# EAGLE design elysium_v0_7 (EAGLE 6.5.0)
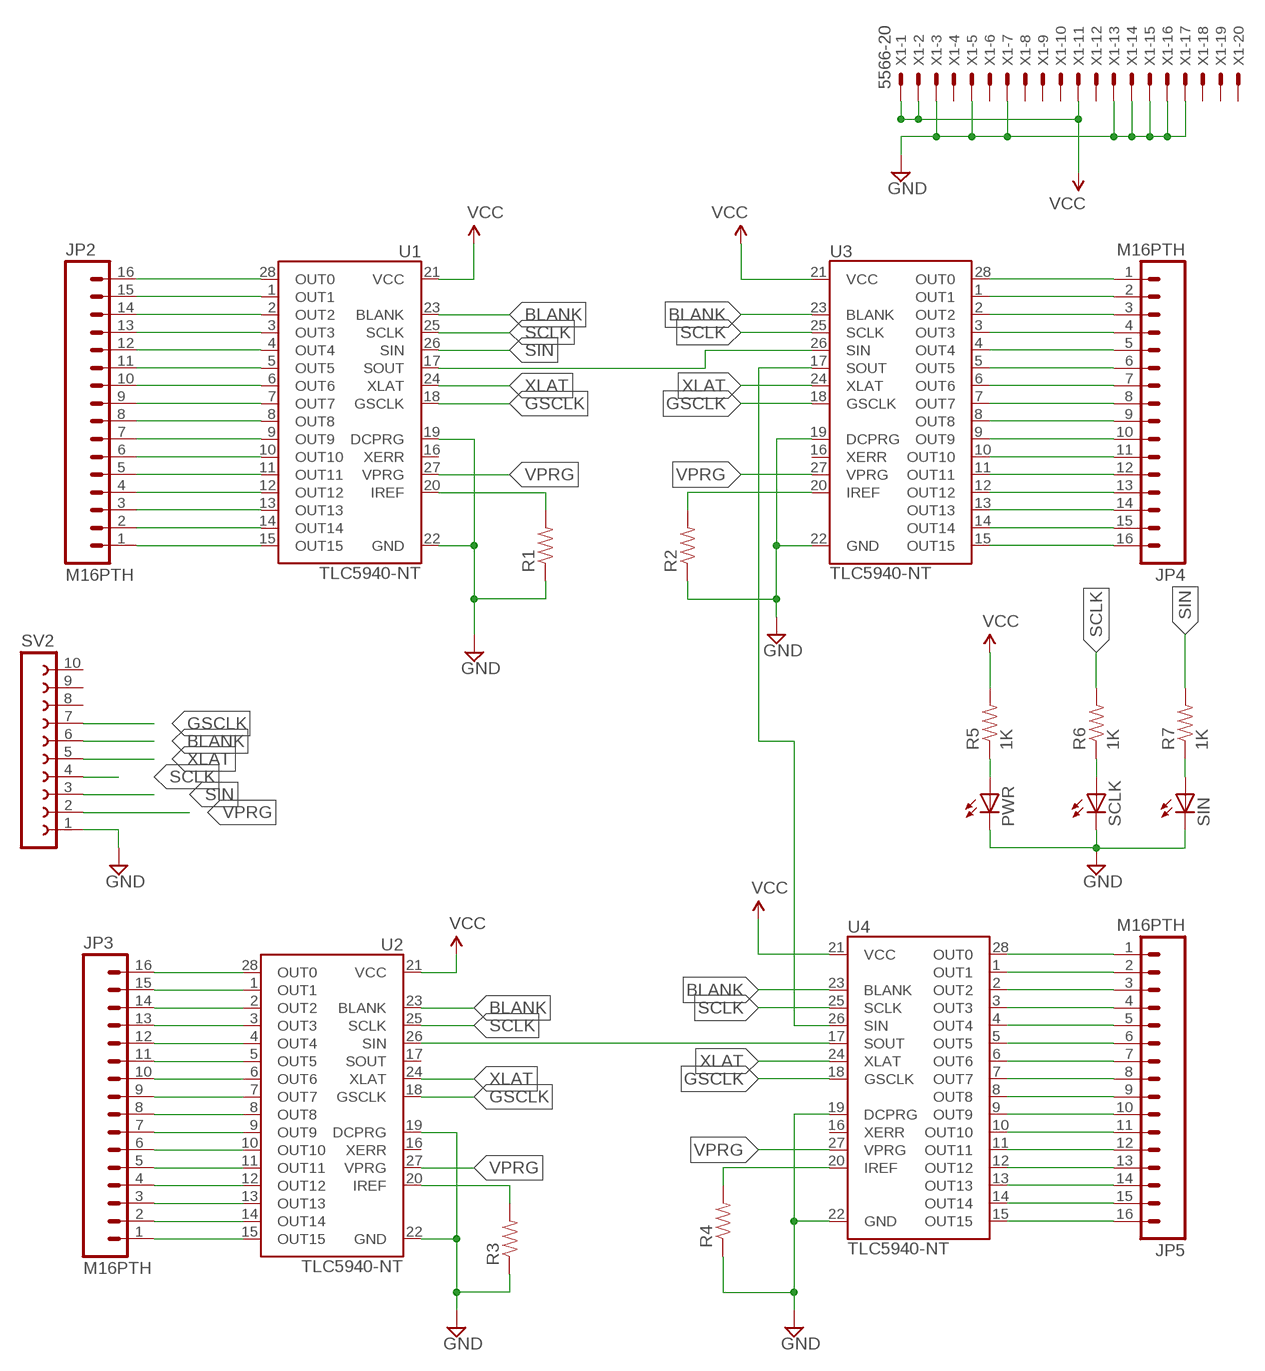
[diagram p0: schematic, sheet 1]

## Parts
JP2  M16PTH  [1X16]
JP3  M16PTH  [1X16]
JP4  M16PTH  [1X16]
JP5  M16PTH  [1X16]
PWR  LED5MM  [LED5MM]
R1  RESISTOREZ  [AXIAL-0.3EZ]
R2  RESISTOREZ  [AXIAL-0.3EZ]
R3  RESISTOREZ  [AXIAL-0.3EZ]
R4  RESISTOREZ  [AXIAL-0.3EZ]
R5  1K  RESISTOREZ  [AXIAL-0.3EZ]
R6  1K  RESISTOREZ  [AXIAL-0.3EZ]
R7  1K  RESISTOREZ  [AXIAL-0.3EZ]
SCLK  LED5MM  [LED5MM]
SIN  LED5MM  [LED5MM]
SV2  FE10-1  [FE10]
U1  TLC5940-NT  [DIL28-3]
U2  TLC5940-NT  [DIL28-3]
U3  TLC5940-NT  [DIL28-3]
U4  TLC5940-NT  [DIL28-3]
X1  5566-20  [5566-20]

## Nets
BLANK: SV2.6 U1.23(BLANK) U2.23(BLANK) U3.23(BLANK) U4.23(BLANK)
GND: PWR.K(C) R1.P$1 R2.P$1 R3.P$1 R4.P$1 SCLK.K(C) SIN.K(C) SV2.1 U1.19(DCPRG) U1.22(GND) U2.19(DCPRG) U2.22(GND) U3.19(DCPRG) U3.22(GND) U4.19(DCPRG) U4.22(GND) X1.3 X1.5 X1.7 X1.13 X1.14 X1.15 X1.16 X1.17
GSCLK: SV2.7 U1.18(GSCLK) U2.18(GSCLK) U3.18(GSCLK) U4.18(GSCLK)
N$1: JP2.16 U1.28(OUT0)
N$2: JP2.15 U1.1(OUT1)
N$3: JP2.14 U1.2(OUT2)
N$4: JP2.13 U1.3(OUT3)
N$5: JP2.12 U1.4(OUT4)
N$6: JP2.11 U1.5(OUT5)
N$7: JP2.10 U1.6(OUT6)
N$8: JP2.9 U1.7(OUT7)
N$9: JP2.8 U1.8(OUT8)
N$10: JP2.7 U1.9(OUT9)
N$11: JP2.6 U1.10(OUT10)
N$12: JP2.5 U1.11(OUT11)
N$13: JP2.4 U1.12(OUT12)
N$14: JP2.3 U1.13(OUT13)
N$15: JP2.2 U1.14(OUT14)
N$16: JP2.1 U1.15(OUT15)
N$17: JP4.1 U3.28(OUT0)
N$18: JP4.2 U3.1(OUT1)
N$19: JP4.3 U3.2(OUT2)
N$20: JP4.4 U3.3(OUT3)
N$21: JP4.5 U3.4(OUT4)
N$22: JP4.6 U3.5(OUT5)
N$23: JP4.7 U3.6(OUT6)
N$24: JP4.8 U3.7(OUT7)
N$25: JP4.9 U3.8(OUT8)
N$26: JP4.10 U3.9(OUT9)
N$27: JP4.11 U3.10(OUT10)
N$28: JP4.12 U3.11(OUT11)
N$29: JP4.13 U3.12(OUT12)
N$30: JP4.14 U3.13(OUT13)
N$31: JP4.15 U3.14(OUT14)
N$32: JP4.16 U3.15(OUT15)
N$33: JP3.16 U2.28(OUT0)
N$34: JP3.15 U2.1(OUT1)
N$35: JP3.14 U2.2(OUT2)
N$36: JP3.13 U2.3(OUT3)
N$37: JP3.12 U2.4(OUT4)
N$38: JP3.11 U2.5(OUT5)
N$39: JP3.10 U2.6(OUT6)
N$40: JP3.9 U2.7(OUT7)
N$41: JP3.8 U2.8(OUT8)
N$42: JP3.7 U2.9(OUT9)
N$43: JP3.6 U2.10(OUT10)
N$44: JP3.5 U2.11(OUT11)
N$45: JP3.4 U2.12(OUT12)
N$46: JP3.3 U2.13(OUT13)
N$47: JP3.2 U2.14(OUT14)
N$48: JP3.1 U2.15(OUT15)
N$49: JP5.1 U4.28(OUT0)
N$50: JP5.2 U4.1(OUT1)
N$51: JP5.3 U4.2(OUT2)
N$52: JP5.4 U4.3(OUT3)
N$53: JP5.5 U4.4(OUT4)
N$54: JP5.6 U4.5(OUT5)
N$55: JP5.7 U4.6(OUT6)
N$56: JP5.8 U4.7(OUT7)
N$57: JP5.9 U4.8(OUT8)
N$58: JP5.10 U4.9(OUT9)
N$59: JP5.11 U4.10(OUT10)
N$60: JP5.12 U4.11(OUT11)
N$61: JP5.13 U4.12(OUT12)
N$62: JP5.14 U4.13(OUT13)
N$63: JP5.15 U4.14(OUT14)
N$64: JP5.16 U4.15(OUT15)
N$65: U1.17(SOUT) U3.26(SIN)
N$66: U3.17(SOUT) U4.26(SIN)
N$67: U2.26(SIN) U4.17(SOUT)
N$68: R1.P$2 U1.20(IREF)
N$69: PWR.A R5.P$1
N$70: R2.P$2 U3.20(IREF)
N$74: R6.P$1 SCLK.A
N$75: R3.P$2 U2.20(IREF)
N$76: R7.P$1 SIN.A
N$77: R4.P$2 U4.20(IREF)
SCLK: R6.P$2 SV2.4 U1.25(SCLK) U2.25(SCLK) U3.25(SCLK) U4.25(SCLK)
SIN: R7.P$2 SV2.3 U1.26(SIN)
VCC: R5.P$2 U1.21(VCC) U2.21(VCC) U3.21(VCC) U4.21(VCC) X1.1 X1.2 X1.11
VPRG: SV2.2 U1.27(VPRG) U2.27(VPRG) U3.27(VPRG) U4.27(VPRG)
XLAT: SV2.5 U1.24(XLAT) U2.24(XLAT) U3.24(XLAT) U4.24(XLAT)
Unconnected: SV2.8 SV2.9 SV2.10 U1.16(XERR) U2.16(XERR) U2.17(SOUT) U3.16(XERR) U4.16(XERR) X1.4 X1.6 X1.8 X1.9 X1.10 X1.12 X1.18 X1.19 X1.20

## Library data of the parts
JP2-JP5 = SparkFun-Connectors:M16: 1x16 .1" header
PWR SCLK SIN = adafruit:LED: LED OSRAM: - CHIPLED LG R971, LG N971, LY N971, LG Q971, LY Q971, LO R971, LY R971 LH N974, LH R974 LS Q976, LO Q976, LY Q976 LO Q996 - Hyper CHIPLED LW Q18S LB Q993, LB Q99A, LB R99A - SideLED LS A670, LO A670, LY A670, LG A670, LP A670 LB A673, LV A673, LT A673, LW A673 LH A674 LY A675 LS A676, LA A676, LO A676, LY A676, LW A676 LS A679, LY A679, LG A679 - Hyper Micro SIDELED® LS Y876, LA Y876, LO Y876, LY Y876 LT Y87S - SmartLED LW L88C, LW L88S LB L89C, LB L89S, LG L890 LS L89K, LO L89K, LY L89K LS L896, LA L896, LO L896, LY L896 - TOPLED LS T670, LO T670, LY T670, LG T670, LP T670 LSG T670, LSP T670, LSY T670, LOP T670, LYG T670 LG T671, LOG T671, LSG T671 LB T673, LV T673, LT T673, LW T673 LH T674 LS T676, LA T676, LO T676, LY T676, LB T676, LH T676, LSB T676, LW T676 LB T67C, LV T67C, LT T67C, LS T67K, LO T67K, LY T67K, LW E67C LS E67B, LA E67B, LO E67B, LY E67B, LB E67C, LV E67C, LT E67C LW T67C LS T679, LY T679, LG T679 LS T770, LO T770, LY T770, LG T770, LP T770 LB T773, LV T773, LT T773, LW T773 LH T774 LS E675, LA E675, LY E675, LS T675 LS T776, LA T776, LO T776, LY T776, LB T776 LHGB T686 LT T68C, LB T68C - Hyper Mini TOPLED® LB M676 - Mini TOPLED Santana® LG M470 LS M47K, LO M47K, LY M47K Source: http://www.osram.convergy.de/
R1-R7 = SparkFun-Resistors:RESISTOR: Resistor Basic schematic elements and footprints for 0603, 1206, and PTH resistors.
SV2 = con-lsta:FE10-1: FEMALE HEADER; OC_FARNELL: unknown; OC_NEWARK: unknown
U1-U4 = SparkFun-DigitalIC:TLC5940: 16-channel LED Driver with Dot Correction and Grayscale PWM Control The TLC5940 is a 16-channel, constant-current sink LED driver. Each channel has an individually adjustable 4096-step grayscale PWM brightness control and a 64-step, constant-current sink (dot correction). The dot correction adjusts the brightness variations between LED channels and other LED drivers. The dot correction data is stored in an integrated EEPROM. Both grayscale control and dot correction are accessible via a serial interface. A single external resistor sets the maximum current value of all 16 channels. Packages: 28-pin HTSSOP 32-pin 5x5mm QFN 28-pin DIP
X1 = con-molex:5566-20: Mini FIT connector 20 pol ATX PC-Motherboard Power connector Source: http://www.molex.com; OC_FARNELL: unknown; OC_NEWARK: unknown

## Board
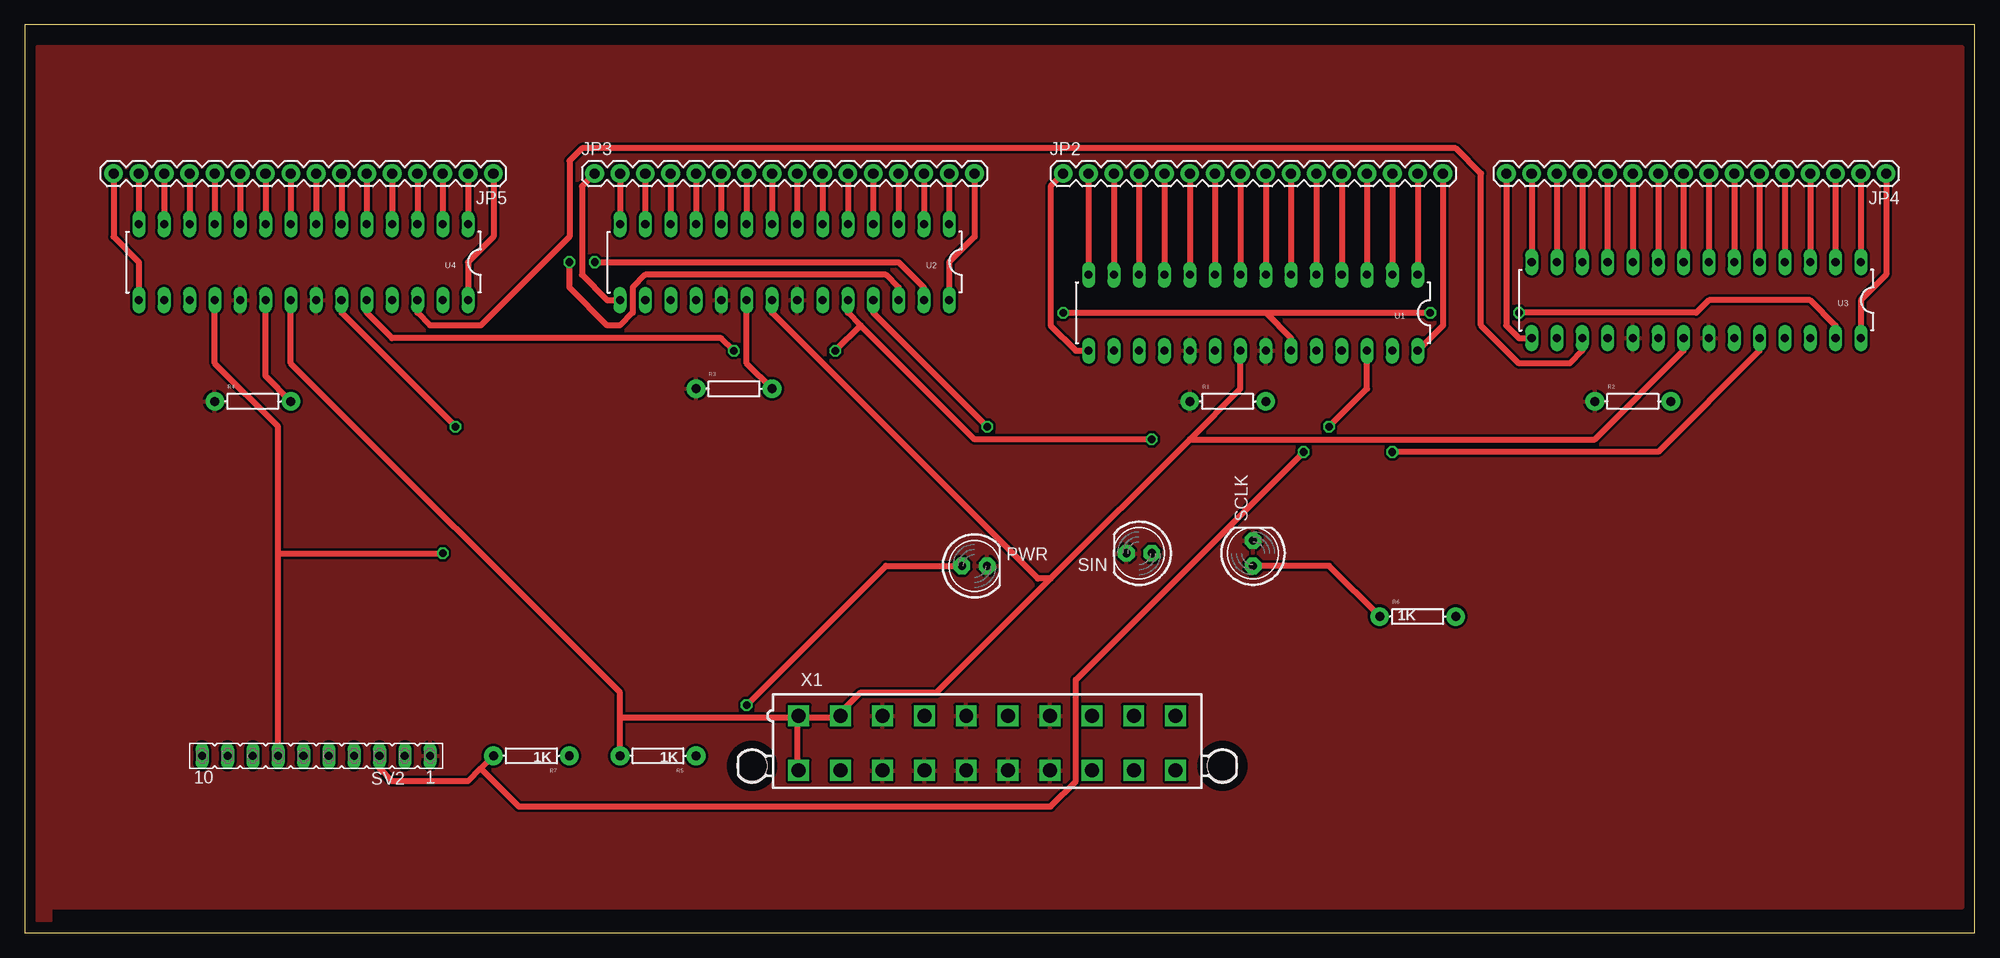
[diagram p1: board, top side]
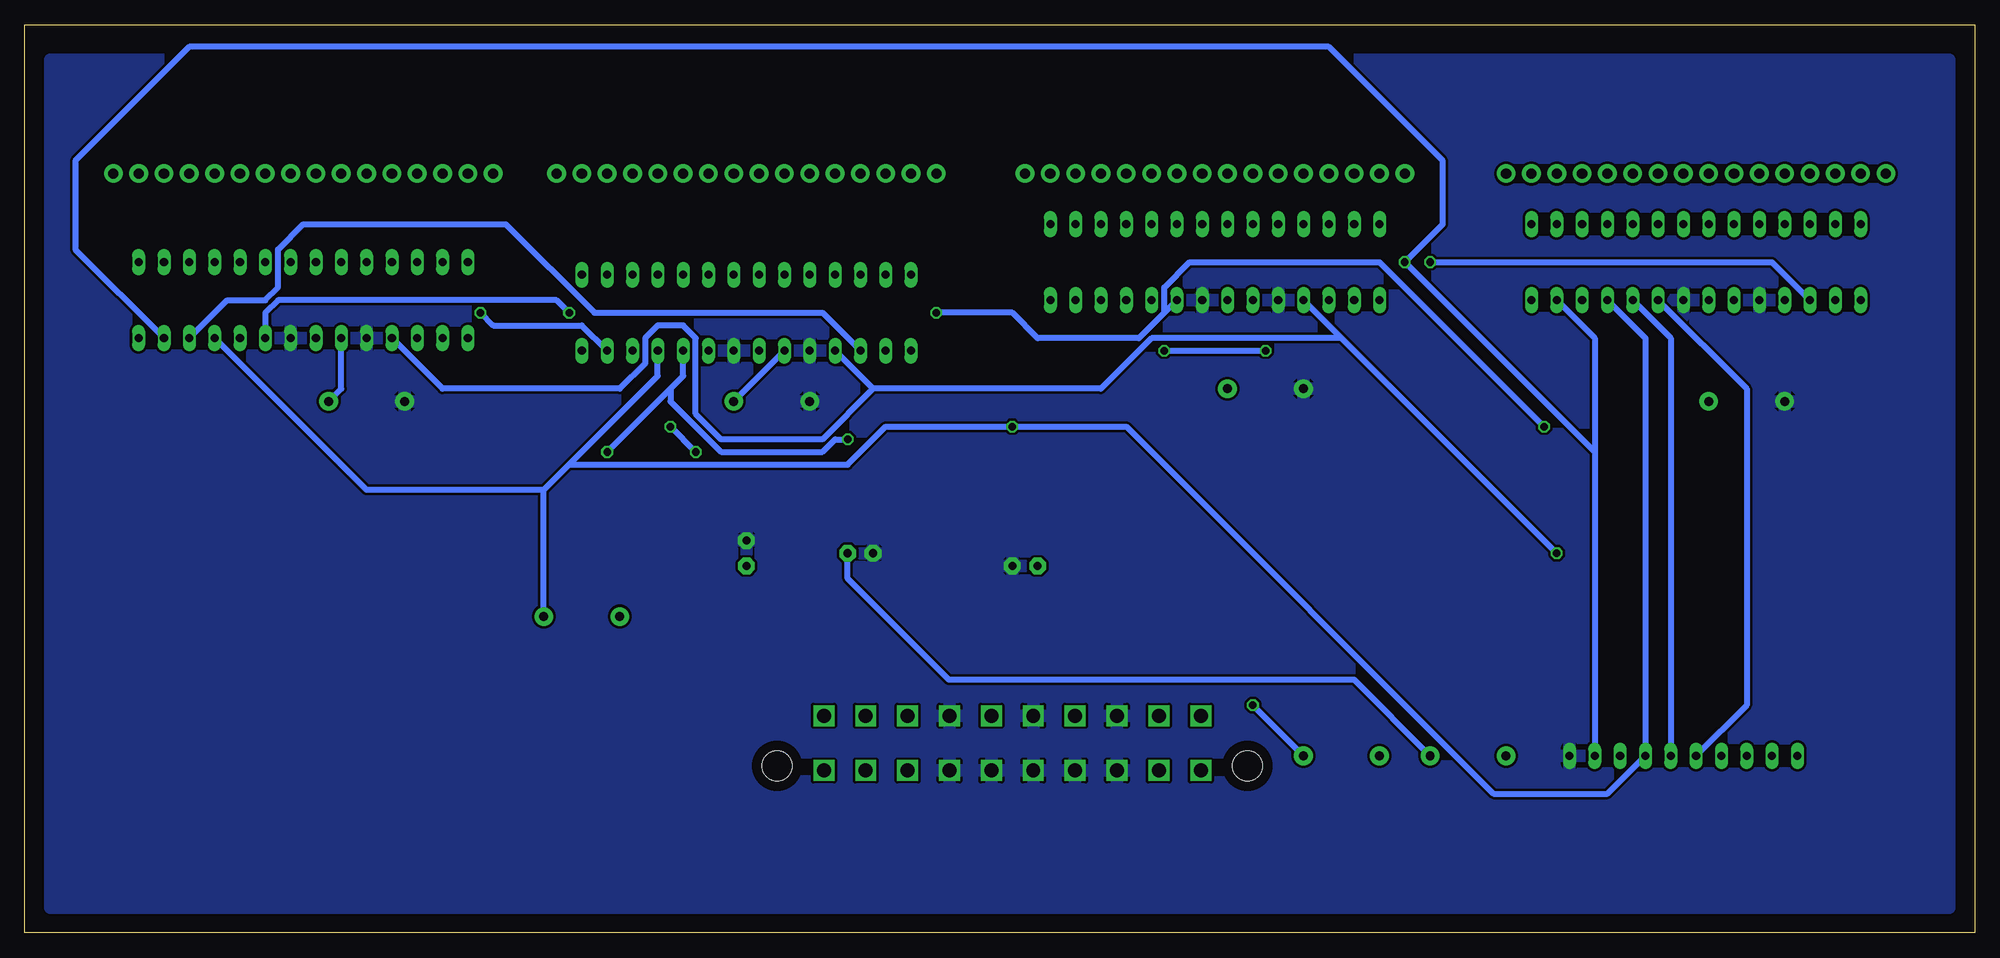
[diagram p2: board, bottom side, seen from below]

Size 195.56 x 91.11 mm. Coordinates in mm from the lower left corner, seen from the top.
Outline: 0,0 195.56,0 195.56,91.11 0,91.11 0,0
Copper layers (1*16): Top 0.035mm / dielectric 1.5mm / Bottom 0.035mm
Design rules "default *": minimum track width 24mil, minimum drill 30mil, track to track 10mil, track to pad 10mil, pad to pad 10mil, via to via 10mil, smd to smd 8mil, copper to edge 40mil, drill to drill 8mil, minimum pad ring 10mil, minimum via ring 8mil, stop-mask expansion 4mil, vias tented up to drill 0mil, thermal gap 10mil
vRestrict: area 8.9,61 to 45.7,72.4; area 72.4,63.5 to 109.2,74.9; area 137.2,63.5 to 174,74.9; area 204.5,63.5 to 242.6,73.7; area 86.4,12.7 to 133.3,25.4

### Footprints (pad centres in the part's own frame; a part is rotated, then mirrored left to right if it is on the bottom)
1X16 = drill 1.016 pad 1.88: 1 0,0; 2 2.54,0; 3 5.08,0; 4 7.62,0; 5 10.16,0; 6 12.7,0; 7 15.24,0; 8 17.78,0; 9 20.32,0; 10 22.86,0; 11 25.4,0; 12 27.94,0; 13 30.48,0; 14 33.02,0; 15 35.56,0; 16 38.1,0
LED5MM = drill 0.813 pad 1.676 octagon: A -1.27,0; K 1.27,0
AXIAL-0.3EZ = drill 0.9 pad 1.88: P$1 -3.81,0; P$2 3.81,0
FE10 = drill 0.813 long: 1 -11.43,0; 2 -8.89,0; 3 -6.35,0; 4 -3.81,0; 5 -1.27,0; 6 1.27,0; 7 3.81,0; 8 6.35,0; 9 8.89,0; 10 11.43,0
DIL28-3 = drill 0.813 long: 1 -16.51,-3.81; 2 -13.97,-3.81; 3 -11.43,-3.81; 4 -8.89,-3.81; 5 -6.35,-3.81; 6 -3.81,-3.81; 7 -1.27,-3.81; 8 1.27,-3.81; 9 3.81,-3.81; 10 6.35,-3.81; 11 8.89,-3.81; 12 11.43,-3.81; 13 13.97,-3.81; 14 16.51,-3.81; 15 16.51,3.81; 16 13.97,3.81; 17 11.43,3.81; 18 8.89,3.81; 19 6.35,3.81; 20 3.81,3.81; 21 1.27,3.81; 22 -1.27,3.81; 23 -3.81,3.81; 24 -6.35,3.81; 25 -8.89,3.81; 26 -11.43,3.81; 27 -13.97,3.81; 28 -16.51,3.81
5566-20 = drill 1.4 square: 1 18.9,-2.75; 2 14.7,-2.75; 3 10.5,-2.75; 4 6.3,-2.75; 5 2.1,-2.75; 6 -2.1,-2.75; 7 -6.3,-2.75; 8 -10.5,-2.75; 9 -14.7,-2.75; 10 -18.9,-2.75; 11 18.9,2.75; 12 14.7,2.75; 13 10.5,2.75; 14 6.3,2.75; 15 2.1,2.75; 16 -2.1,2.75; 17 -6.3,2.75; 18 -10.5,2.75; 19 -14.7,2.75; 20 -18.9,2.75 | hole 3: 23.6,2.29; -23.6,2.29

### Placement (x,y rotation side)
JP2  104.14,76.2 0 top
JP3  57.15,76.2 0 top
JP4  186.69,76.2 180 top
JP5  46.99,76.2 180 top
PWR  95.25,36.83 0 top
R1  120.65,53.34 0 top
R2  161.29,53.34 0 top
R3  71.12,54.61 0 top
R4  22.86,53.34 0 top
R5  63.5,17.78 180 top
R6  139.7,31.75 0 top
R7  50.8,17.78 180 top
SCLK  123.19,38.1 90 top
SIN  111.76,38.1 180 top
SV2  29.21,17.78 180 top
U1  123.19,62.23 180 top
U2  76.2,67.31 180 top
U3  167.64,63.5 180 top
U4  27.94,67.31 180 top
X1  96.52,19.05 180 top

### Tracks (layer width: path | path; a pad name or v marks a point on that pad's centre or on a via)
BLANK  (via drill 0.76)
  Top 0.61: U1.23 127,59.69 124.46,62.23 | v104.14,62.23 124.46,62.23 | 124.46,62.23 v140.97,62.23 | U4.23 31.75,62.23 v43.18,50.8
  Bottom 0.61: SV2.6 22.86,22.86 22.86,54.61 U4.23 | v104.14,62.23 96.52,62.23 93.98,59.69 83.82,59.69 81.28,62.23 | U2.23 81.28,62.23 | U3.23 171.45,62.23 170.18,63.5 142.24,63.5 v140.97,62.23 | v43.18,50.8 59.69,67.31 78.74,67.31 81.28,64.77 81.28,62.23
GND
  pour Bottom: 2.54,87.63 2.54,2.54 193.04,2.54 193.04,87.63
  pour Top: 1.27,88.9 194.31,88.9 194.31,80.01 194.31,2.54 2.54,2.54 2.54,1.27 1.27,1.27
GSCLK  (via drill 0.76)
  Top 0.61: U4.18 19.05,57.15 25.4,50.8 25.4,38.1 | SV2.7 25.4,38.1 | 25.4,38.1 v41.91,38.1
  Bottom 0.61: v41.91,38.1 63.5,59.69 | 63.5,59.69 U2.18 | 110.49,54.61 U1.18 | 110.49,54.61 87.63,54.61 82.55,59.69 63.5,59.69 | U3.18 153.67,54.61 135.89,54.61 133.35,57.15 133.35,59.69 132.08,60.96 129.54,60.96 128.27,59.69 128.27,52.07 125.73,49.53 115.57,49.53 110.49,54.61
N$1
  Top 0.61: U1.28 142.24,60.96 JP2.16
N$2
  Top 0.61: JP2.15 U1.1
N$3
  Top 0.61: JP2.14 U1.2
N$4
  Top 0.61: JP2.13 U1.3
N$5
  Top 0.61: JP2.12 U1.4
N$6
  Top 0.61: JP2.11 U1.5
N$7
  Top 0.61: JP2.10 U1.6
N$8
  Top 0.61: JP2.9 U1.7
N$9
  Top 0.61: JP2.8 U1.8
N$10
  Top 0.61: JP2.7 U1.9
N$11
  Top 0.61: JP2.6 U1.10
N$12
  Top 0.61: JP2.5 U1.11
N$13
  Top 0.61: JP2.4 U1.12
N$14
  Top 0.61: JP2.3 U1.13
N$15
  Top 0.61: JP2.2 U1.14
N$16
  Top 0.61: U1.15 105.41,58.42 102.87,60.96 102.87,74.93 JP2.1
N$17
  Top 0.61: U3.28 184.15,63.5 186.69,66.04 JP4.1
N$18
  Top 0.61: JP4.2 U3.1
N$19
  Top 0.61: JP4.3 U3.2
N$20
  Top 0.61: JP4.4 U3.3
N$21
  Top 0.61: JP4.5 U3.4
N$22
  Top 0.61: JP4.6 U3.5
N$23
  Top 0.61: JP4.7 U3.6
N$24
  Top 0.61: JP4.8 U3.7
N$25
  Top 0.61: JP4.9 U3.8
N$26
  Top 0.61: JP4.10 U3.9
N$27
  Top 0.61: JP4.11 U3.10
N$28
  Top 0.61: JP4.12 U3.11
N$29
  Top 0.61: JP4.13 U3.12
N$30
  Top 0.61: JP4.14 U3.13
N$31
  Top 0.61: JP4.15 U3.14
N$32
  Top 0.61: U3.15 149.86,59.69 148.59,60.96 JP4.16
N$33
  Top 0.61: U2.28 92.71,67.31 95.25,69.85 JP3.16
N$34
  Top 0.61: JP3.15 U2.1
N$35
  Top 0.61: JP3.14 U2.2
N$36
  Top 0.61: JP3.13 U2.3
N$37
  Top 0.61: JP3.12 U2.4
N$38
  Top 0.61: JP3.11 U2.5
N$39
  Top 0.61: JP3.10 U2.6
N$40
  Top 0.61: JP3.9 U2.7
N$41
  Top 0.61: JP3.8 U2.8
N$42
  Top 0.61: JP3.7 U2.9
N$43
  Top 0.61: JP3.6 U2.10
N$44
  Top 0.61: JP3.5 U2.11
N$45
  Top 0.61: JP3.4 U2.12
N$46
  Top 0.61: JP3.3 U2.13
N$47
  Top 0.61: JP3.2 U2.14
N$48
  Top 0.61: U2.15 58.42,63.5 55.88,66.04 55.88,74.93 JP3.1
N$49
  Top 0.61: U4.28 44.45,67.31 46.99,69.85 JP5.1
N$50
  Top 0.61: JP5.2 U4.1
N$51
  Top 0.61: JP5.3 U4.2
N$52
  Top 0.61: JP5.4 U4.3
N$53
  Top 0.61: JP5.5 U4.4
N$54
  Top 0.61: JP5.6 U4.5
N$55
  Top 0.61: JP5.7 U4.6
N$56
  Top 0.61: JP5.8 U4.7
N$57
  Top 0.61: JP5.9 U4.8
N$58
  Top 0.61: JP5.10 U4.9
N$59
  Top 0.61: JP5.11 U4.10
N$60
  Top 0.61: JP5.12 U4.11
N$61
  Top 0.61: JP5.13 U4.12
N$62
  Top 0.61: JP5.14 U4.13
N$63
  Top 0.61: JP5.15 U4.14
N$64
  Top 0.61: U4.15 11.43,67.31 8.89,69.85 JP5.16
N$65
  Bottom 0.61: U1.17 115.57,62.23 138.43,62.23 147.32,71.12 167.64,71.12 170.18,68.58 170.18,64.77 171.45,63.5 175.26,63.5 U3.26
N$66
  Top 0.61: U4.26 39.37,62.23 40.64,60.96 45.72,60.96 54.61,69.85 54.61,77.47 55.88,78.74 143.51,78.74 146.05,76.2 146.05,60.96 149.86,57.15 154.94,57.15 156.21,58.42 U3.17
N$67  (via drill 0.76)
  Top 0.61: v54.61,67.31 54.61,64.77 58.42,60.96 59.69,60.96 60.96,62.23 60.96,64.77 62.23,66.04 86.36,66.04 87.63,64.77 U2.26
  Bottom 0.61: U4.17 20.32,67.31 v54.61,67.31
N$68
  Bottom 0.61: R1.P$2 U1.20
N$69  (via drill 0.76)
  Top 0.61: PWR.A 86.36,36.83 v72.39,22.86
  Bottom 0.61: R5.P$1 v72.39,22.86
N$70
  Bottom 0.61: U3.20 163.83,54.61 R2.P$2
N$74
  Top 0.61: SCLK.A 130.81,36.83 R6.P$1
N$75
  Top 0.61: U2.20 72.39,57.15 R3.P$2
N$76
  Bottom 0.61: SIN.A 113.03,35.56 102.87,25.4 62.23,25.4 R7.P$1
N$77
  Top 0.61: U4.20 24.13,55.88 R4.P$2
SCLK  (via drill 0.76)
  Top 0.61: U2.25 85.09,62.23 v96.52,50.8
  Bottom 0.61: U4.25 33.02,59.69 SV2.4 36.83,13.97 48.26,13.97 85.09,50.8 v96.52,50.8 109.22,50.8 113.03,46.99 140.97,46.99 | U1.25 132.08,55.88 140.97,46.99 | 143.51,44.45 140.97,46.99 | R6.P$2 143.51,44.45 | U3.25 161.29,44.45 143.51,44.45
SIN  (via drill 0.76)
  Top 0.61: SV2.3 35.56,16.51 36.83,15.24 44.45,15.24 45.72,16.51 | R7.P$2 45.72,16.51 | U1.26 134.62,54.61 v130.81,50.8 | v128.27,48.26 105.41,25.4 105.41,15.24 102.87,12.7 49.53,12.7 45.72,16.51
  Bottom 0.61: v128.27,48.26 v130.81,50.8
VCC
  Top 0.61: U4.21 26.67,57.15 59.69,24.13 59.69,21.59 | R5.P$2 59.69,21.59 | 77.47,21.59 77.47,16.51 X1.11 | U1.21 121.92,54.61 116.84,49.53 | 102.87,35.56 91.44,24.13 83.82,24.13 81.28,21.59 | 102.87,35.56 116.84,49.53 | U3.21 166.37,58.42 157.48,49.53 116.84,49.53 | U2.21 74.93,62.23 101.6,35.56 102.87,35.56 | 81.28,21.59 77.47,21.59 | 81.28,21.59 X1.2 | 77.47,21.59 59.69,21.59 | 77.47,21.59 X1.1
VPRG  (via drill 0.76)
  Top 0.61: v149.86,62.23 167.64,62.23 168.91,63.5 179.07,63.5 181.61,60.96 U3.27 | U2.27 90.17,64.77 87.63,67.31 v57.15,67.31
  Bottom 0.61: U1.27 139.7,60.96 148.59,60.96 v149.86,62.23 | 38.1,48.26 38.1,59.69 U4.27 | 38.1,48.26 SV2.2 | 38.1,48.26 v57.15,67.31 53.34,71.12 53.34,77.47 64.77,88.9 179.07,88.9 190.5,77.47 190.5,68.58 U3.27
XLAT  (via drill 0.76)
  Top 0.61: v137.16,48.26 163.83,48.26 173.99,58.42 U3.24 | U2.24 82.55,62.23 83.82,60.96 | 83.82,60.96 95.25,49.53 v113.03,49.53 | U4.24 34.29,62.23 36.83,59.69 69.85,59.69 v71.12,58.42 | 83.82,60.96 v81.28,58.42
  Bottom 0.61: SV2.5 30.48,59.69 U4.24 | U1.24 129.54,55.88 130.81,54.61 | v137.16,48.26 130.81,54.61 | v113.03,49.53 114.3,49.53 115.57,48.26 125.73,48.26 130.81,53.34 130.81,54.61 | v81.28,58.42 v71.12,58.42